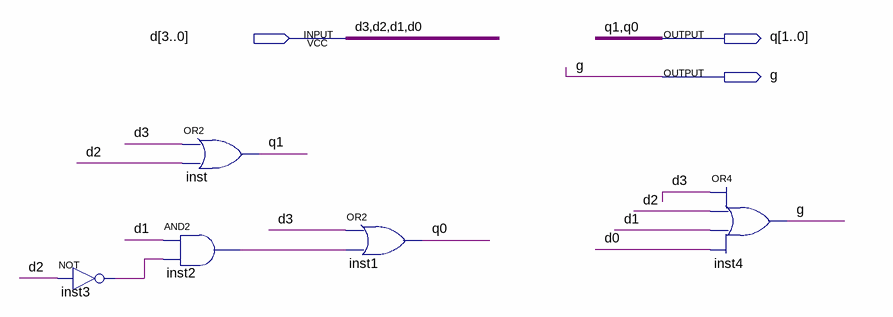
[diagram p0: schematic sheet]
// Quartus schematic s33_cd.bdf as structural Verilog: 5 symbols, 3 pins
module s33_cd (
  input  [3:0] d,
  output [1:0] q,
  output g
);

  wire inst2_out, inst3_out;

  not inst3 (inst3_out, d[2]);
  or inst (q[1], d[3], d[2]);
  and inst2 (inst2_out, d[1], inst3_out);
  or inst1 (q[0], d[3], inst2_out);
  or inst4 (g, d[3], d[2], d[1], d[0]);
endmodule
